# Altium schematic sheet STM3205P_DACSPI.SchDoc
size A3; Organization: Canis Tech; Address1: -; Address2: -; Address3: -; Address4: Indaiatuba/SP; DocumentNumber: 5; SheetNumber: 5; SheetTotal: 9; Address5: Brazil
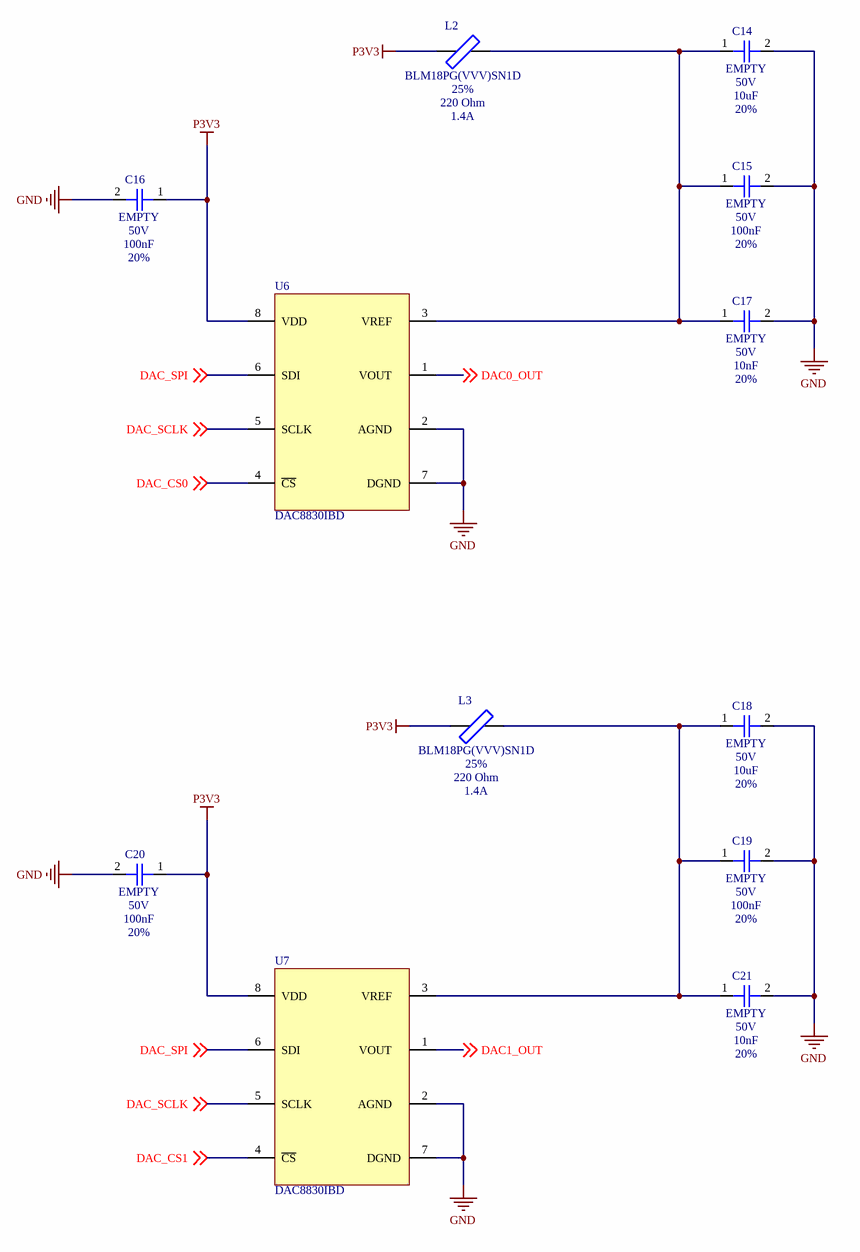
[diagram p0: STM3205P_DACSPI.SchDoc]

## Parts
C14  value 10uF  PartNumber1: EMPTY  Voltage: 50V  Tolerance: 20%  [CAP0603]  (hidden comment: CC0603)
C15  value 100nF  PartNumber1: EMPTY  Voltage: 50V  Tolerance: 20%  [CAP0603]  (hidden comment: CC0603)
C16  value 100nF  PartNumber1: EMPTY  Voltage: 50V  Tolerance: 20%  [CAP0603]  (hidden comment: CC0603)
C17  value 10nF  PartNumber1: EMPTY  Voltage: 50V  Tolerance: 20%  [CAP0603]  (hidden comment: CC0603)
C18  value 10uF  PartNumber1: EMPTY  Voltage: 50V  Tolerance: 20%  [CAP0603]  (hidden comment: CC0603)
C19  value 100nF  PartNumber1: EMPTY  Voltage: 50V  Tolerance: 20%  [CAP0603]  (hidden comment: CC0603)
C20  value 100nF  PartNumber1: EMPTY  Voltage: 50V  Tolerance: 20%  [CAP0603]  (hidden comment: CC0603)
C21  value 10nF  PartNumber1: EMPTY  Voltage: 50V  Tolerance: 20%  [CAP0603]  (hidden comment: CC0603)
L2  value 220 Ohm  PartNumber1: BLM18PG(VVV)SN1D  Tolerance: 25%  Current: 1.4A  [IND0603]  (hidden comment: BLM18)
L3  value 220 Ohm  PartNumber1: BLM18PG(VVV)SN1D  Tolerance: 25%  Current: 1.4A  [IND0603]  (hidden comment: BLM18)
U6  PartNumber1: DAC8830IBD  [SOIC-08-3.9mm]  (hidden comment: DAC8830ICD)
U7  PartNumber1: DAC8830IBD  [SOIC-08-3.9mm]  (hidden comment: DAC8830ICD)

## Nets
GND: C14.2 C15.2 C16.2 C17.2 C18.2 C19.2 C20.2 C21.2 U6.2(AGND) U6.7(DGND) U7.2(AGND) U7.7(DGND)
P3V3: C16.1 C20.1 L2.2 L3.2 U6.8(VDD) U7.8(VDD)
DAC0_OUT: U6.1(VOUT) ; off-sheet DAC0_OUT
DAC1_OUT: U7.1(VOUT) ; off-sheet DAC1_OUT
DAC_CS0: U6.4(~{CS}) ; off-sheet DAC_CS0
DAC_CS1: U7.4(~{CS}) ; off-sheet DAC_CS1
DAC_SCLK: U6.5(SCLK) U7.5(SCLK) ; off-sheet DAC_SCLK
DAC_SPI: U6.6(SDI) U7.6(SDI) ; off-sheet DAC_SPI
NetC14_1: C14.1 C15.1 C17.1 L2.1 U6.3(VREF)
NetC18_1: C18.1 C19.1 C21.1 L3.1 U7.3(VREF)

## Notes on the sheet
- Title
- Author
- Checked By
- Variant
- Size:
- Revision:
- A3
- Date:
- Project
- Time:
- Sheet
- of
- File:

## Library data of the parts
C14-C21 = CC0603: Surface Mount Multilayer Ceramic Chip Capacitors  for Commercial Applications; Manufacturer1: Yageo; Published: 19-Jun-2016; LatestRevisionDate: 19-Jun-2016; Publisher: Lucas Moraes; PackageReference: CAP0603; PackageDescription: CAP0603;2 Leads
L2 L3 = BLM18: Ferrite Beads 0603; Manufacturer1: Murata Electronics; Code: 221; LatestRevisionDate: 22-Dec-2016; PackageReference: IND0603; Publisher: Lucas Moraes; PackageDescription: IND0603; 2 Leads; Published: 22-Dec-2016
U6 U7 = DAC8830ICD: DAC Lo-Pwr R-To-R Output 16-Bit Serial Input; Manufacturer1: Texas Instruments; Published: 02-Apr-2025; LatestRevisionDate: 02-Apr-2025; LatestRevisionNote: Created; PackageReference: SOIC-08-3.9mm; Publisher: Lucas Moraes; PackageDescription: SOIC-08-3.9mm; 8 Leads; Datasheet: https://www.ti.com/lit/ds/symlink/dac8830.pdf